# EAGLE design LEDBLINK (EAGLE 9.2.2)
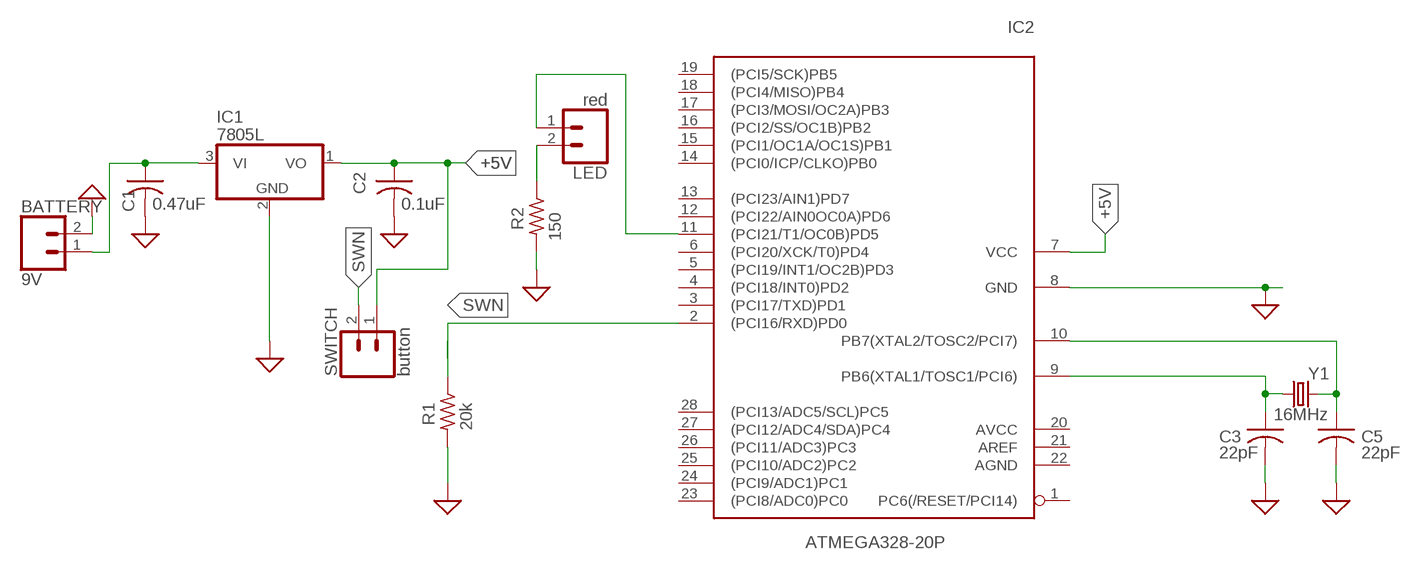
[diagram p0: schematic, sheet 1]

## Parts
BATTERY  9V  CONN_02  [1X02]
C1  0.47uF  C-USC0805  [C0805]
C2  0.1uF  C-USC0805  [C0805]
C3  22pF  C-USC0805  [C0805]
C5  22pF  C-USC0805  [C0805]
IC1  7805L  [TO92]
IC2  ATMEGA328-20P  [DIL28-3]
LED  red  CONN_02  [1X02]
R1  20k  R-US_R0805  [R0805]
R2  150  R-US_R0805  [R0805]
SWITCH  button  CONN_02  [1X02]
Y1  16MHz  CRYSTAL-16MHZPTH-HC49US  [HC49US]

## Nets
+5V: C2.1 IC1.1(VO) IC2.7(VCC) SWITCH.1
GND: BATTERY.2 C1.2 C2.2 C3.2 C5.2 IC1.2(GND) IC2.8(GND) R1.2 R2.2 ; supply symbol labelled SUP
N$1: C3.1 IC2.9(PB6(XTAL1/TOSC1/PCI6)) Y1.1
N$2: BATTERY.1 C1.1 IC1.3(VI)
N$3: LED.2 R2.1
N$10: C5.1 IC2.10(PB7(XTAL2/TOSC2/PCI7)) Y1.2
PWM_PIN: IC2.11((PCI21/T1/OC0B)PD5) LED.1
SWN: IC2.2((PCI16/RXD)PD0) R1.1 SWITCH.2
Unconnected: IC2.1(PC6(/RESET/PCI14)) IC2.3((PCI17/TXD)PD1) IC2.4((PCI18/INT0)PD2) IC2.5((PCI19/INT1/OC2B)PD3) IC2.6((PCI20/XCK/T0)PD4) IC2.12((PCI22/AIN0OC0A)PD6) IC2.13((PCI23/AIN1)PD7) IC2.14((PCI0/ICP/CLKO)PB0) IC2.15((PCI1/OC1A/OC1S)PB1) IC2.16((PCI2/SS/OC1B)PB2) IC2.17((PCI3/MOSI/OC2A)PB3) IC2.18((PCI4/MISO)PB4) IC2.19((PCI5/SCK)PB5) IC2.20(AVCC) IC2.21(AREF) IC2.22(AGND) IC2.23((PCI8/ADC0)PC0) IC2.24((PCI9/ADC1)PC1) IC2.25((PCI10/ADC2)PC2) IC2.26((PCI11/ADC3)PC3) IC2.27((PCI12/ADC4/SDA)PC4) IC2.28((PCI13/ADC5/SCL)PC5)

## Library data of the parts
BATTERY LED SWITCH = SparkFun-Connectors:CONN_02: Multi connection point. Often used as Generic Header-pin footprint for 0.1 inch spaced/style header connections On any of the 0.1 inch spaced packages, you can populate with these: Break Away Headers - Straight <https://www.sparkfun.com/products/116> (PRT-00116) Break Away Male Headers - Right Angle <https://www.sparkfun.com/products/553> (PRT-00553) Female Headers <https://www.sparkfun.com/products/115> (PRT-00115) Break Away Headers - Machine Pin <https://www.sparkfun.com/products/117> (PRT-00117) Break Away Female Headers - Swiss Machine Pin <https://www.sparkfun.com/products/743> (PRT-00743) For SCREWTERMINALS and SPRING TERMINALS visit here: Screw Terimnals on SparkFun.com <https://www.sparkfun.com/search/results?term=Screw+Terminals> (5mm/3.5mm/2.54mm spacing) This device is also useful as a general connection point to wire up your design to another part of your project. Our various solder wires solder well into these plated through hole pads. Hook-Up Wire - Assortment (Stranded, 22 AWG) <https://www.sparkfun.com/products/11375> (PRT-11375) Hook-Up Wire - Assortment (Solid Core, 22 AWG) <https://www.sparkfun.com/products/11367> (PRT-11367) View the entire wire category on our website here <https://www.sparkfun.com/categories/141> Special notes: Molex polarized connector foot print use with: PRT-08233 with associated crimp pins and housings. 2.54_SCREWTERM for use with PRT-10571. 3.5mm Screw Terminal footprints for PRT-08084 5mm Screw Terminal footprints for use with PRT-08432
C1-C3 C5 = adafruit:C-US: CAPACITOR, American symbol
IC1 = adafruit:78*: Positive VOLTAGE REGULATOR Added bigger pads to the TO-92 package
IC2 = atmega328:ATMEGA328*P: MICROCONTROLLER 32 kBytes FLASH 2 kBytes SRAM 1 kBytes EEPROM USART 8-channel 10 bit ADC
R1 R2 = adafruit:R-US_: RESISTOR, American symbol
Y1 = SparkFun-Clocks:CRYSTAL-16MHZ: 16MHz Crystal Digikey Example <http://www.digikey.com/product-search/en?keywords=535-9122-1-ND> Frequency: 16MHz Frequency Stability: ±50ppm Frequency Tolerance: ±20ppm Load Capacitance: 18pF SparkFun Products: Pro Micro -5V/16MHz <https://www.sparkfun.com/products/12640> SparkFun Serial Enabled LCD Kit <https://www.sparkfun.com/products/10097>; PROD_ID: XTAL-08181; SF_ID: COM-00536

## Net classes
0 default: width 0.305 mm, drill 0.508 mm, clearance 0.254 mm

## Board
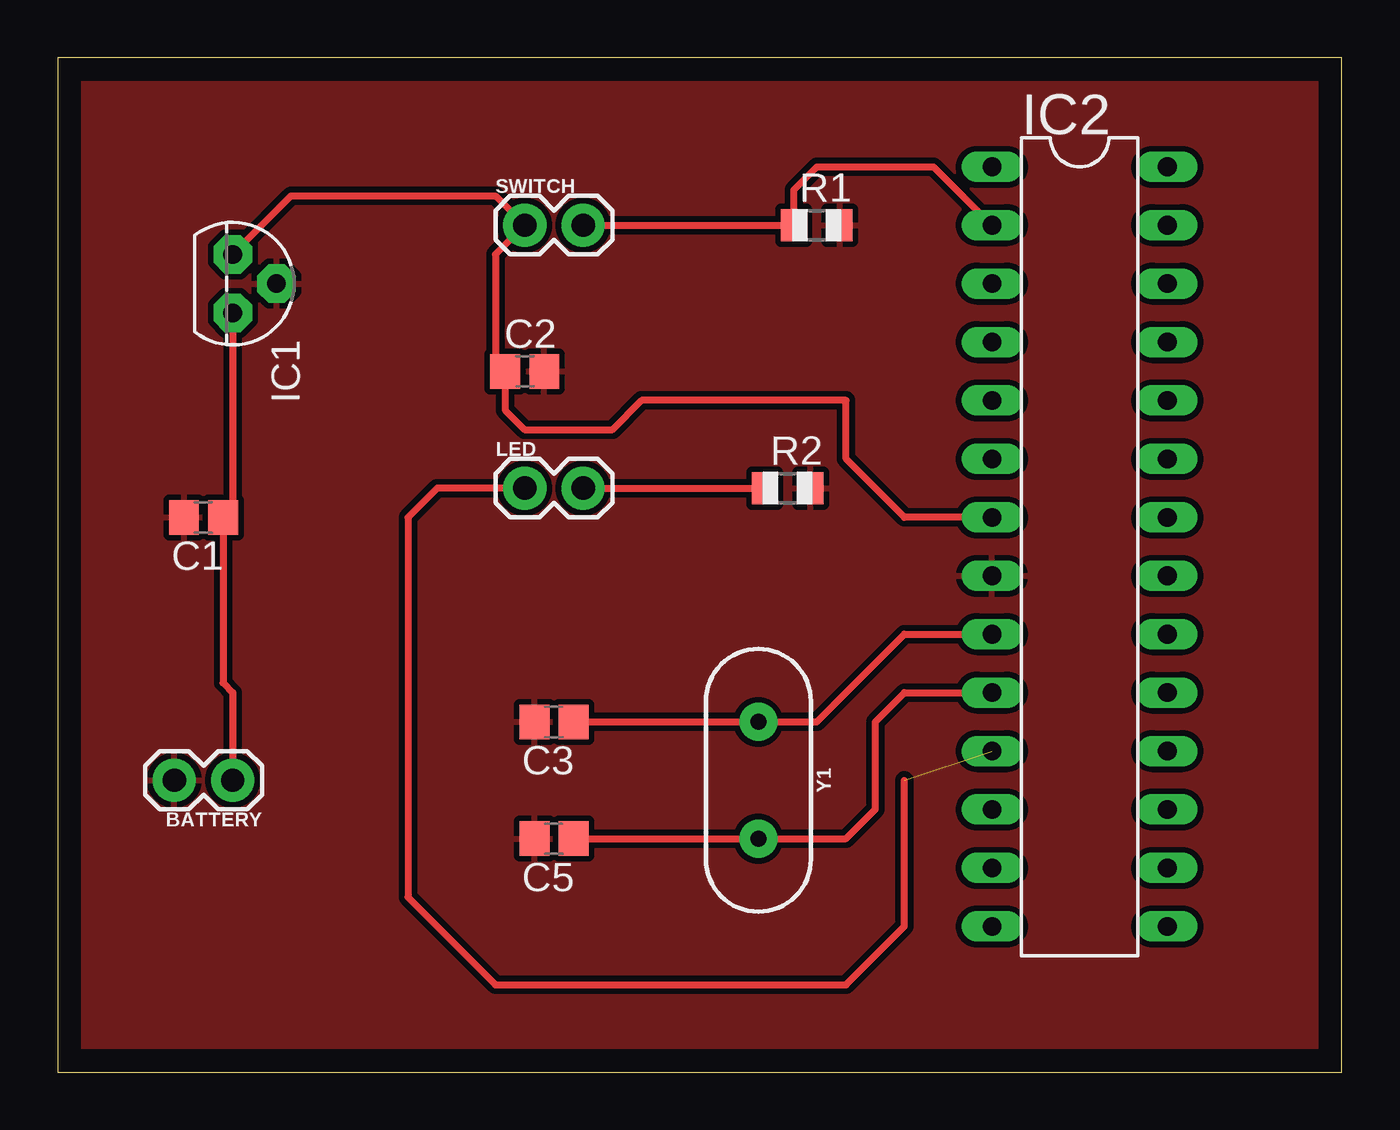
[diagram p1: board, top side]

Size 55.86 x 44.12 mm. Coordinates in mm from the lower left corner, seen from the top.
Outline: 0,0 55.86,0 55.86,44.12 0,44.12 0,0
Copper layers (1*16): Top 0.035mm / dielectric 1.5mm / Bottom 0.035mm
Design rules "default": minimum track width 6mil, minimum drill 0.35mm, track to track 6mil, track to pad 6mil, pad to pad 6mil, via to via 6mil, smd to smd 6mil, copper to edge 40mil, drill to drill 6mil, minimum pad ring 10mil, minimum via ring 8mil, stop-mask expansion 4mil, vias tented up to drill 0mil, thermal gap 10mil

### Footprints (pad centres in the part's own frame; a part is rotated, then mirrored left to right if it is on the bottom)
1X02 = drill 1.016 pad 1.88: 1 0,0; 2 2.54,0
C0805 = smd 1.3 x 1.5: 1 -0.85,0; 2 0.85,0
TO92 = drill 0.813 pad 1.676 octagon: 1 -1.27,0; 2 0,1.905; 3 1.27,0
DIL28-3 = drill 0.813 long: 1 -16.51,-3.81; 2 -13.97,-3.81; 3 -11.43,-3.81; 4 -8.89,-3.81; 5 -6.35,-3.81; 6 -3.81,-3.81; 7 -1.27,-3.81; 8 1.27,-3.81; 9 3.81,-3.81; 10 6.35,-3.81; 11 8.89,-3.81; 12 11.43,-3.81; 13 13.97,-3.81; 14 16.51,-3.81; 15 16.51,3.81; 16 13.97,3.81; 17 11.43,3.81; 18 8.89,3.81; 19 6.35,3.81; 20 3.81,3.81; 21 1.27,3.81; 22 -1.27,3.81; 23 -3.81,3.81; 24 -6.35,3.81; 25 -8.89,3.81; 26 -11.43,3.81; 27 -13.97,3.81; 28 -16.51,3.81
R0805 = smd 1.1 x 1.4: 1 -1,0; 2 1,0
HC49US = drill 0.7 pad 1.651: 1 -2.54,0; 2 2.54,0

### Placement (x,y rotation side)
BATTERY  7.62,12.7 180 top
C1  6.35,24.13 180 top
C2  20.32,30.48 0 top
C3  21.59,15.24 180 top
C5  21.59,10.16 180 top
IC1  7.62,34.29 270 top
IC2  44.45,22.86 270 top
LED  20.32,25.4 0 top
R1  33.02,36.83 0 top
R2  31.75,25.4 0 top
SWITCH  20.32,36.83 0 top
Y1  30.48,12.7 270 top

### Tracks (layer width: path | path; a pad name or v marks a point on that pad's centre or on a via)
+5V
  Top 0.305: IC1.1 10.16,38.1 19.05,38.1 SWITCH.1 19.05,35.56 19.05,30.9 C2.1 19.47,28.79 20.32,27.94 24.13,27.94 25.4,29.21 34.29,29.21 34.29,26.67 36.83,24.13 IC2.7
GND
  pour Top: -5.08,55.88 59.69,55.88 59.69,-3.81 -5.08,-3.81
N$1
  Top 0.305: C3.1 Y1.1 33.02,15.24 36.83,19.05 IC2.9
N$2
  Top 0.305: 7.2,13.12 BATTERY.1 7.62,16.51 7.2,16.93 C1.1 7.62,24.13 IC1.3
N$3
  Top 0.305: LED.2 R2.1
N$10
  Top 0.305: C5.1 Y1.2 34.29,10.16 35.56,11.43 35.56,15.24 36.83,16.51 IC2.10
PWM_PIN  (1 unrouted)
  Top 0.305: LED.1 16.51,25.4 15.24,24.13 15.24,7.62 19.05,3.81 34.29,3.81 36.83,6.35 | 36.83,6.35 | 36.83,6.35 36.83,12.7
SWN
  Top 0.305: SWITCH.2 R1.1 32.02,38.37 33.02,39.37 38.1,39.37 IC2.2